# Altium schematic sheet 03_Mos.SchDoc
size A4
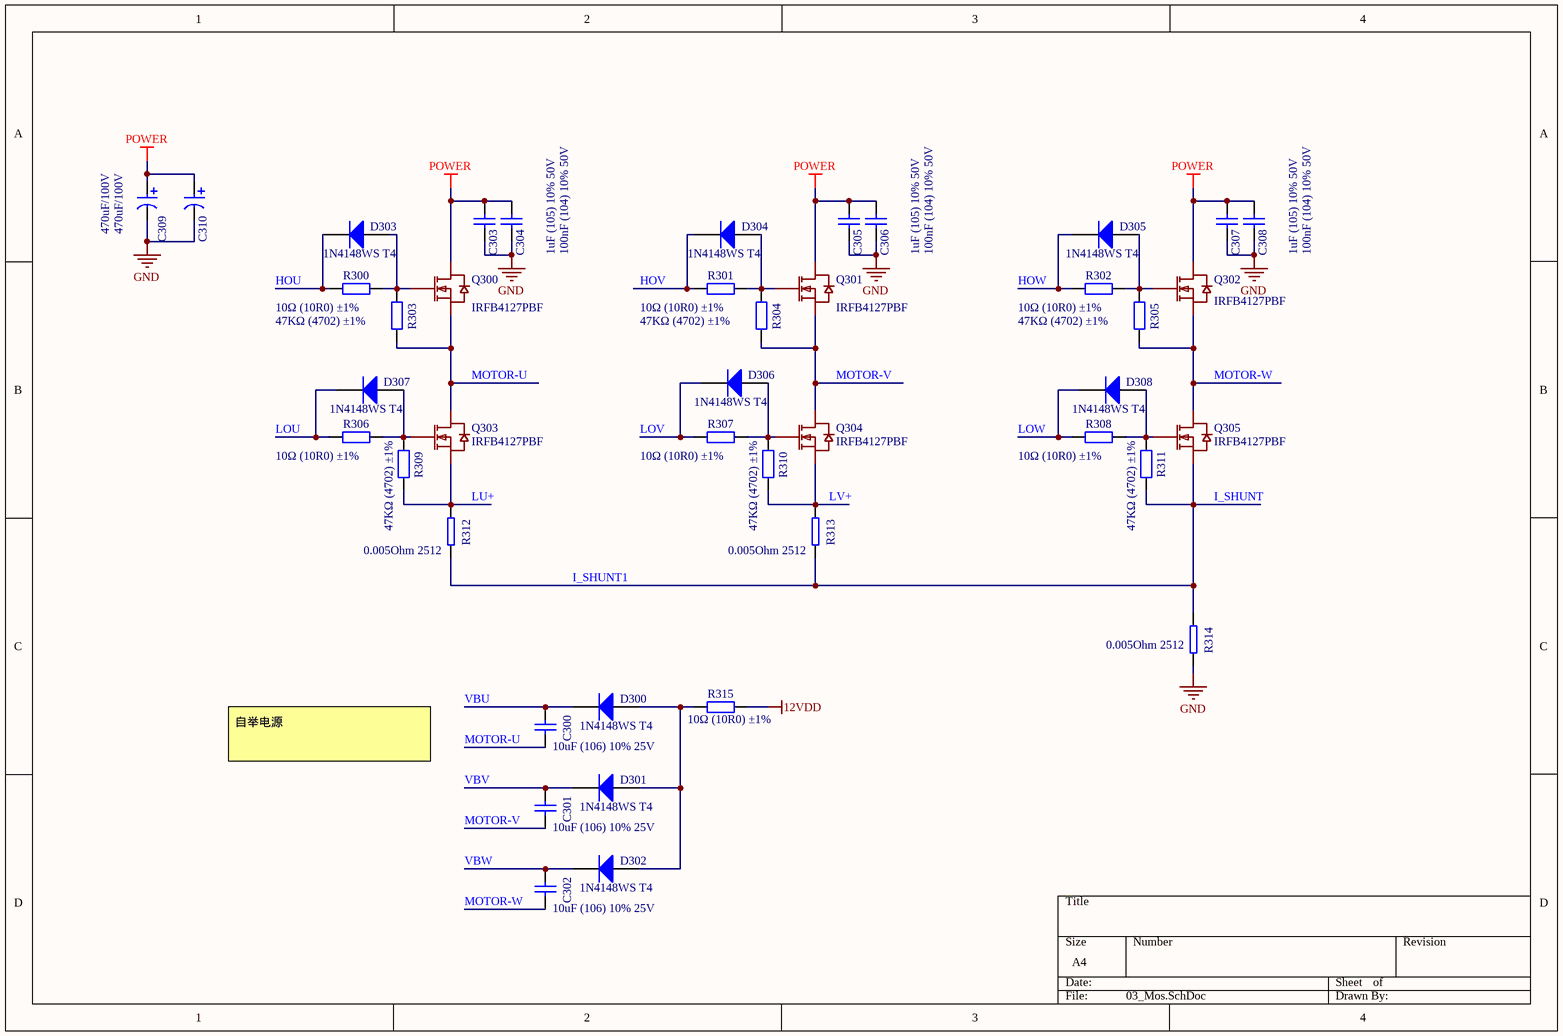
[diagram p0: 03_Mos.SchDoc]

## Parts
C300  10uF (106) 10% 25V  [0805_C]
C301  10uF (106) 10% 25V  [0805_C]
C302  10uF (106) 10% 25V  [0805_C]
C303  100nF (104) 10% 50V  [1206_C]
C304  1uF (105) 10% 50V  [1206_C]
C305  100nF (104) 10% 50V  [1206_C]
C306  1uF (105) 10% 50V  [1206_C]
C307  100nF (104) 10% 50V  [1206_C]
C308  1uF (105) 10% 50V  [1206_C]
C309  470uF/100V  [CAP_D16_L31.5]
C310  470uF/100V  [CAP_D16_L31.5]
D300  1N4148WS T4  [SOD-323]
D301  1N4148WS T4  [SOD-323]
D302  1N4148WS T4  [SOD-323]
D303  1N4148WS T4  [SOD-323]
D304  1N4148WS T4  [SOD-323]
D305  1N4148WS T4  [SOD-323]
D306  1N4148WS T4  [SOD-323]
D307  1N4148WS T4  [SOD-323]
D308  1N4148WS T4  [SOD-323]
Q300  IRFB4127PBF  [IRFB4127]
Q301  IRFB4127PBF  [IRFB4127]
Q302  IRFB4127PBF  [IRFB4127]
Q303  IRFB4127PBF  [IRFB4127]
Q304  IRFB4127PBF  [IRFB4127]
Q305  IRFB4127PBF  [IRFB4127]
R300  10Ω (10R0) ±1%  [0805_R]
R301  10Ω (10R0) ±1%  [0805_R]
R302  10Ω (10R0) ±1%  [0805_R]
R303  47KΩ (4702) ±1%  [0805_R]
R304  47KΩ (4702) ±1%  [0805_R]
R305  47KΩ (4702) ±1%  [0805_R]
R306  10Ω (10R0) ±1%  [0805_R]
R307  10Ω (10R0) ±1%  [0805_R]
R308  10Ω (10R0) ±1%  [0805_R]
R309  47KΩ (4702) ±1%  [0805_R]
R310  47KΩ (4702) ±1%  [0805_R]
R311  47KΩ (4702) ±1%  [0805_R]
R312  0.005Ohm 2512  [R2512]
R313  0.005Ohm 2512  [R2512]
R314  0.005Ohm 2512  [R2512]
R315  10Ω (10R0) ±1%  [0805_R]

## Nets
12VDD: R315.2
GND: C303.1 C304.1 C305.1 C306.1 C307.1 C308.1 C309.2 C310.2 R314.1
POWER: C303.2 C304.2 C305.2 C306.2 C307.2 C308.2 C309.1 C310.1 Q300.2(D) Q301.2(D) Q302.2(D)
HOU: D303.2(K) R300.1
HOV: D304.2(K) R301.1
HOW: D305.2(K) R302.1
I_SHUNT: Q305.3(S) R311.1 R312.1 R313.1 R314.2  [also labelled I_SHUNT1]
LOU: D307.2(K) R306.1
LOV: D306.2(K) R307.1
LOW: D308.2(K) R308.1
LU+: Q303.3(S) R309.1 R312.2
LV+: Q304.3(S) R310.1 R313.2
MOTOR-U: C300.1 Q300.3(S) Q303.2(D) R303.1
MOTOR-V: C301.1 Q301.3(S) Q304.2(D) R304.1
MOTOR-W: C302.1 Q302.3(S) Q305.2(D) R305.1
VBU: C300.2 D300.2(K)
VBV: C301.2 D301.2(K)
VBW: C302.2 D302.2(K)
NetD300_1: D300.1(A) D301.1(A) D302.1(A) R315.1
NetD303_1: D303.1(A) Q300.1(G) R300.2 R303.2
NetD304_1: D304.1(A) Q301.1(G) R301.2 R304.2
NetD305_1: D305.1(A) Q302.1(G) R302.2 R305.2
NetD306_1: D306.1(A) Q304.1(G) R307.2 R310.2
NetD307_1: D307.1(A) Q303.1(G) R306.2 R309.2
NetD308_1: D308.1(A) Q305.1(G) R308.2 R311.2

## Notes on the sheet
- 自举电源

## Library data of the parts
C300-C302 = 0805 10uF (106) 10% 25V: 贴片电容; ComponentLink1Description: 供应商链接; ComponentLink1URL: http://www.szlcsc.com/product/details_16532.html; Package: 0805; Supplier: LC; SuppliersPartNumber: C15850
C303 C305 C307 = 1206 100nF (104) 10% 50V: 贴片电容; ComponentLink1Description: 供应商链接; ComponentLink1URL: http://www.szlcsc.com/product/details_25237.html; Package: 1206; Supplier: LC; SuppliersPartNumber: C24497
C304 C306 C308 = 1206 1uF (105) 10% 50V: 贴片电容; ComponentLink1Description: 供应商链接; ComponentLink1URL: http://www.szlcsc.com/product/details_2200.html; Package: 1206; Supplier: LC; SuppliersPartNumber: C1848
C309 C310 = CAP2: 电解电容
D300-D308 = SOD-323 1N4148WS T4: 二极管; ComponentLink1Description: 供应商链接; ComponentLink1URL: http://www.szlcsc.com/product/details_2485.html; Package: SOD-323; Supplier: LC; SuppliersPartNumber: C2128
R300-R302 R306-R308 R315 = 0805 10Ω (10R0) 1%: 贴片电阻; ComponentLink1Description: 供应商链接; ComponentLink1URL: http://www.szlcsc.com/product/details_18103.html; Package: 0805; Supplier: LC; SuppliersPartNumber: C17415
R303-R305 R309-R311 = 0805 47KΩ (4702) 1%: 贴片电阻; ComponentLink1Description: 供应商链接; ComponentLink1URL: http://www.szlcsc.com/product/details_18401.html; Package: 0805; Supplier: LC; SuppliersPartNumber: C17713
R312-R314 = Res10K